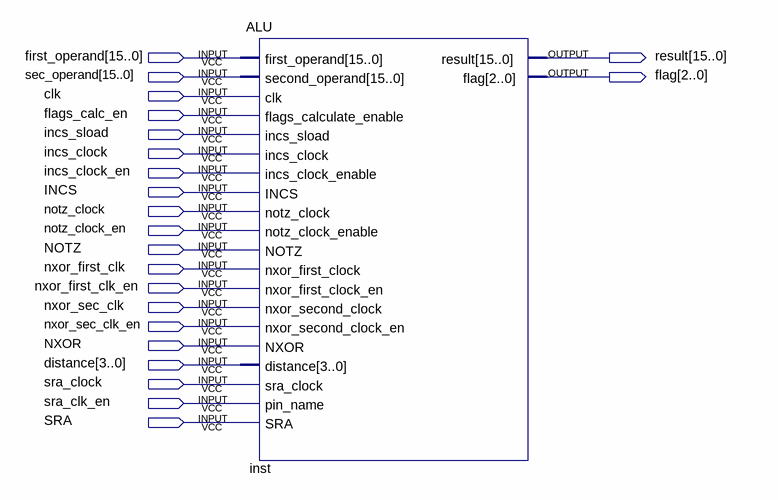
[diagram p0: schematic sheet]
// Quartus schematic ALU_TEST.bdf as structural Verilog: 1 symbols, 22 pins
module ALU_TEST (
  input  [15:0] first_operand,
  input  [15:0] sec_operand,
  input  clk,
  input  flags_calc_en,
  input  incs_sload,
  input  incs_clock,
  input  incs_clock_en,
  input  INCS,
  input  notz_clock,
  input  notz_clock_en,
  input  NOTZ,
  input  nxor_first_clk,
  input  nxor_first_clk_en,
  input  nxor_sec_clk,
  input  nxor_sec_clk_en,
  input  NXOR,
  input  [3:0] distance,
  input  sra_clock,
  input  sra_clk_en,
  input  SRA,
  output [15:0] result,
  output [2:0] flag
);

  ALU inst (
    .first_operand(first_operand), .second_operand(sec_operand), .clk(clk),
    .flags_calculate_enable(flags_calc_en), .incs_sload(incs_sload), .incs_clock(incs_clock),
    .incs_clock_enable(incs_clock_en), .INCS(INCS), .notz_clock(notz_clock),
    .notz_clock_enable(notz_clock_en), .NOTZ(NOTZ), .nxor_first_clock(nxor_first_clk),
    .nxor_first_clock_en(nxor_first_clk_en), .nxor_second_clock(nxor_sec_clk),
    .nxor_second_clock_en(nxor_sec_clk_en), .NXOR(NXOR), .distance(distance), .sra_clock(sra_clock),
    .pin_name(sra_clk_en), .SRA(SRA), .result(result), .flag(flag));
endmodule
